# EAGLE schematic ledikuutio (EAGLE 6.1)
Led cube Logic

## Sheet 1 of 3
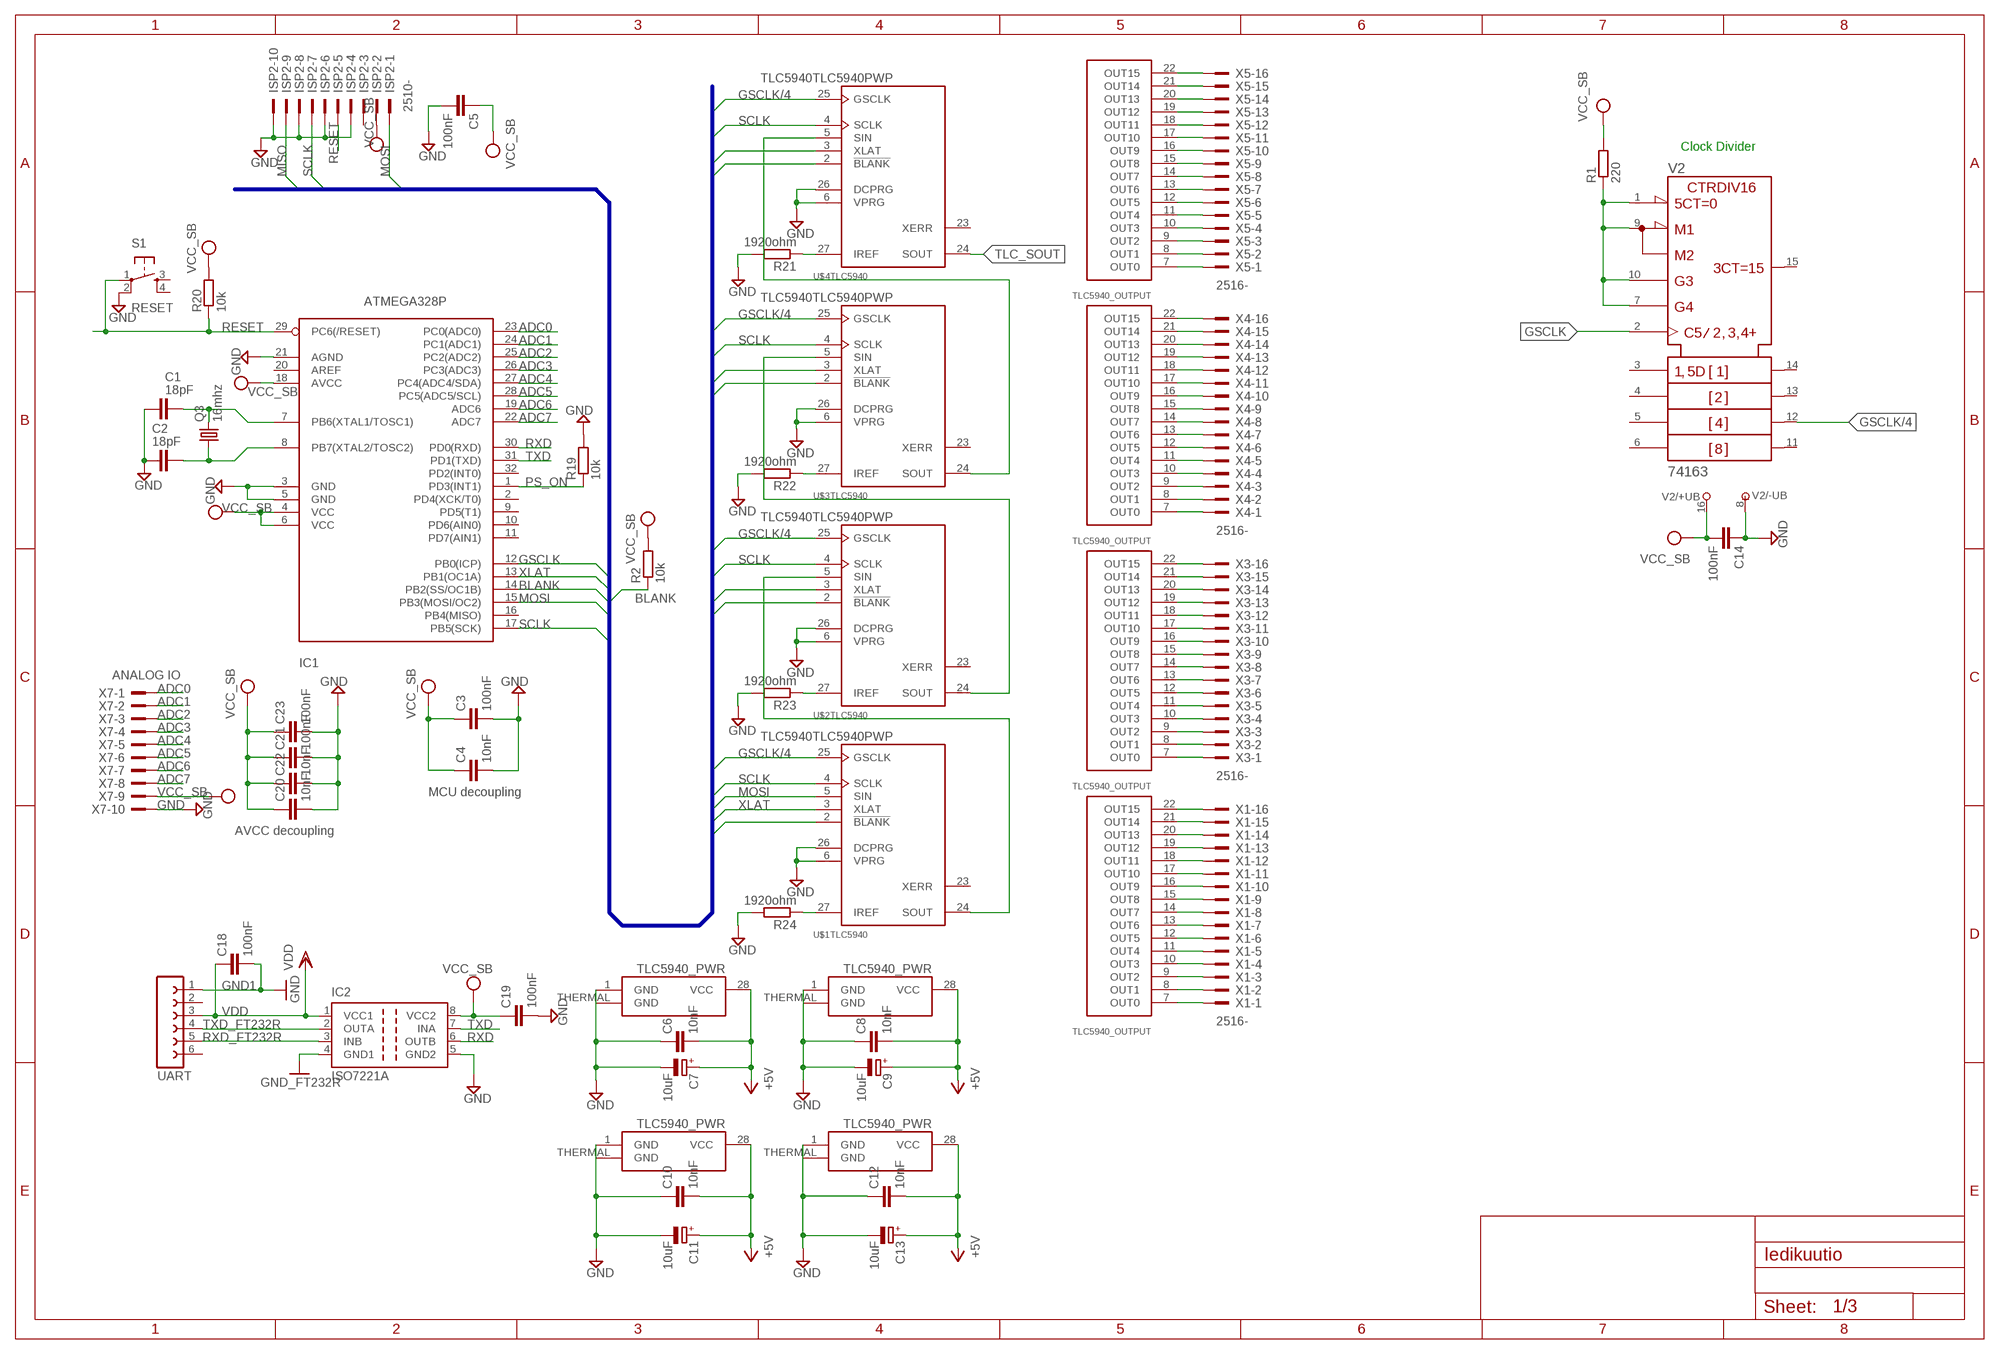
[diagram p0: schematic, sheet 1]

### Parts
C1  18pF  C-EUC0805  [C0805]
C2  18pF  C-EUC0805  [C0805]
C3  100nF  C-EUC0805  [C0805]
C4  10nF  C-EUC0805  [C0805]
C5  100nF  C-EUC0805  [C0805]
C6  10nF  C-EUC0805  [C0805]
C7  10uF  CPOL-EUE2.5-6  [E2,5-6]
C8  10nF  C-EUC0805  [C0805]
C9  10uF  CPOL-EUE2.5-6  [E2,5-6]
C10  10nF  C-EUC0805  [C0805]
C11  10uF  CPOL-EUE2.5-6  [E2,5-6]
C12  10nF  C-EUC0805  [C0805]
C13  10uF  CPOL-EUE2.5-6  [E2,5-6]
C14  100nF  C-EUC0805  [C0805]
C18  100nF  C-EUC0603  [C0603]
C19  100nF  C-EUC0603  [C0603]
C20  10nF  C-EUC0805  [C0805]
C21  100nF  C-EUC0805  [C0805]
C22  10nF  C-EUC0805  [C0805]
C23  100nF  C-EUC0805  [C0805]
IC1  ATMEGA328P  MEGA8-AI  [TQFP32-08]
IC2  ISO7221A  [SO-08]
ISP2  2510-  [PAK100/2500-10]
Q3  16mhz  CRYSTAL5X3  [CRYSTAL-SMD-5X3]
R1  220  R-EU_M0805  [M0805]
R2  10k  R-EU_M0805  [M0805]
R19  10k  R-EU_M0805  [M0805]
R20  10k  R-EU_M0805  [M0805]
R21  1920ohm  R-EU_M0805  [M0805]
R22  1920ohm  R-EU_M0805  [M0805]
R23  1920ohm  R-EU_M0805  [M0805]
R24  1920ohm  R-EU_M0805  [M0805]
S1  RESET  TAC_SWITCHSMD  [TACTILE_SWITCH_SMD]
U$1  TLC5940TLC5940PWP  [PWP28]
U$2  TLC5940TLC5940PWP  [PWP28]
U$3  TLC5940TLC5940PWP  [PWP28]
U$4  TLC5940TLC5940PWP  [PWP28]
UART  FE06-1  [FE06]
V2  74163  [SO16]
X1  2516-  [PAK100/2500-16]
X3  2516-  [PAK100/2500-16]
X4  2516-  [PAK100/2500-16]
X5  2516-  [PAK100/2500-16]
X7  ANALOG IO  2510-  [PAK100/2500-10]

### Nets
+5V [+5V]: C6.2 C7.+ C8.2 C9.+ C10.2 C11.+ C12.2 C13.+ U$1.28(TLC5940_PWR:VCC) U$2.28(TLC5940_PWR:VCC) U$3.28(TLC5940_PWR:VCC) U$4.28(TLC5940_PWR:VCC) ; also sheet 2,3
ADC0: IC1.23(PC0(ADC0)) X7.1
ADC1: IC1.24(PC1(ADC1)) X7.2
ADC2: IC1.25(PC2(ADC2)) X7.3
ADC3: IC1.26(PC3(ADC3)) X7.4
ADC4: IC1.27(PC4(ADC4/SDA)) X7.5
ADC5: IC1.28(PC5(ADC5/SCL)) X7.6
ADC6: IC1.19(ADC6) X7.7
ADC7: IC1.22(ADC7) X7.8
BLANK [digital signal]: IC1.14(PB2(SS/OC1B)) R2.1 U$1.2(TLC5940:!BLANK) U$2.2(TLC5940:!BLANK) U$3.2(TLC5940:!BLANK) U$4.2(TLC5940:!BLANK)
GND: C1.1 C2.2 C3.2 C4.2 C5.2 C6.1 C7.- C8.1 C9.- C10.1 C11.- C12.1 C13.- C14.1 C19.2 C20.2 C21.2 C22.2 C23.2 IC1.3(GND) IC1.5(GND) IC1.21(AGND) IC2.5(GND2) ISP2.4 ISP2.6 ISP2.8 ISP2.10 R19.2 R21.2 R22.2 R23.2 R24.2 S1.2 U$1.1(TLC5940_PWR:GND) U$1.6(TLC5940:VPRG) U$1.26(TLC5940:DCPRG) U$2.1(TLC5940_PWR:GND) U$2.6(TLC5940:VPRG) U$2.26(TLC5940:DCPRG) U$3.1(TLC5940_PWR:GND) U$3.6(TLC5940:VPRG) U$3.26(TLC5940:DCPRG) U$4.1(TLC5940_PWR:GND) U$4.6(TLC5940:VPRG) U$4.26(TLC5940:DCPRG) V2.8(-UB) X7.10 ; also sheet 2,3
GND1: C18.2 IC2.4(GND1) UART.1 ; supply symbol labelled GND, GND_FT232R
GSCLK [digital signal]: IC1.12(PB0(ICP)) V2.2(CLK)
GSCLK/4: U$1.25(TLC5940:GSCLK) U$2.25(TLC5940:GSCLK) U$3.25(TLC5940:GSCLK) U$4.25(TLC5940:GSCLK) V2.12(QC)
MISO: ISP2.9
MOSI [digital signal]: IC1.15(PB3(MOSI/OC2)) ISP2.1 U$1.5(TLC5940:SIN)
N$1: U$1.24(TLC5940:SOUT) U$2.5(TLC5940:SIN)
N$2: C1.2 IC1.7(PB6(XTAL1/TOSC1)) Q3.3
N$3: C2.1 IC1.8(PB7(XTAL2/TOSC2)) Q3.1
N$4: U$2.24(TLC5940:SOUT) U$3.5(TLC5940:SIN)
N$5: R21.1 U$4.27(TLC5940:IREF)
N$6: R23.1 U$2.27(TLC5940:IREF)
N$32: U$1.7(TLC5940_OUTPUT:OUT0) X1.1
N$33: U$1.8(TLC5940_OUTPUT:OUT1) X1.2
N$34: U$1.9(TLC5940_OUTPUT:OUT2) X1.3
N$35: U$1.10(TLC5940_OUTPUT:OUT3) X1.4
N$36: U$1.11(TLC5940_OUTPUT:OUT4) X1.5
N$37: U$1.12(TLC5940_OUTPUT:OUT5) X1.6
N$38: U$1.13(TLC5940_OUTPUT:OUT6) X1.7
N$39: U$1.14(TLC5940_OUTPUT:OUT7) X1.8
N$40: U$1.15(TLC5940_OUTPUT:OUT8) X1.9
N$41: U$1.16(TLC5940_OUTPUT:OUT9) X1.10
N$42: U$1.17(TLC5940_OUTPUT:OUT10) X1.11
N$43: U$1.18(TLC5940_OUTPUT:OUT11) X1.12
N$44: U$1.19(TLC5940_OUTPUT:OUT12) X1.13
N$45: U$1.20(TLC5940_OUTPUT:OUT13) X1.14
N$46: U$1.21(TLC5940_OUTPUT:OUT14) X1.15
N$47: U$1.22(TLC5940_OUTPUT:OUT15) X1.16
N$48: R24.1 U$1.27(TLC5940:IREF)
N$49: U$2.7(TLC5940_OUTPUT:OUT0) X3.1
N$50: U$2.8(TLC5940_OUTPUT:OUT1) X3.2
N$51: U$2.9(TLC5940_OUTPUT:OUT2) X3.3
N$52: U$2.10(TLC5940_OUTPUT:OUT3) X3.4
N$53: U$2.11(TLC5940_OUTPUT:OUT4) X3.5
N$54: U$2.12(TLC5940_OUTPUT:OUT5) X3.6
N$55: U$2.13(TLC5940_OUTPUT:OUT6) X3.7
N$56: U$2.14(TLC5940_OUTPUT:OUT7) X3.8
N$57: U$2.15(TLC5940_OUTPUT:OUT8) X3.9
N$58: U$2.16(TLC5940_OUTPUT:OUT9) X3.10
N$59: U$2.17(TLC5940_OUTPUT:OUT10) X3.11
N$60: U$2.18(TLC5940_OUTPUT:OUT11) X3.12
N$61: U$2.19(TLC5940_OUTPUT:OUT12) X3.13
N$62: U$2.20(TLC5940_OUTPUT:OUT13) X3.14
N$63: U$2.21(TLC5940_OUTPUT:OUT14) X3.15
N$64: U$2.22(TLC5940_OUTPUT:OUT15) X3.16
N$65: U$3.7(TLC5940_OUTPUT:OUT0) X4.1
N$66: U$3.8(TLC5940_OUTPUT:OUT1) X4.2
N$67: U$3.9(TLC5940_OUTPUT:OUT2) X4.3
N$68: U$3.10(TLC5940_OUTPUT:OUT3) X4.4
N$69: U$3.11(TLC5940_OUTPUT:OUT4) X4.5
N$70: U$3.12(TLC5940_OUTPUT:OUT5) X4.6
N$71: U$3.13(TLC5940_OUTPUT:OUT6) X4.7
N$72: U$3.14(TLC5940_OUTPUT:OUT7) X4.8
N$73: U$3.15(TLC5940_OUTPUT:OUT8) X4.9
N$74: U$3.16(TLC5940_OUTPUT:OUT9) X4.10
N$75: U$3.17(TLC5940_OUTPUT:OUT10) X4.11
N$76: U$3.18(TLC5940_OUTPUT:OUT11) X4.12
N$77: U$3.19(TLC5940_OUTPUT:OUT12) X4.13
N$78: U$3.20(TLC5940_OUTPUT:OUT13) X4.14
N$79: U$3.21(TLC5940_OUTPUT:OUT14) X4.15
N$80: U$3.22(TLC5940_OUTPUT:OUT15) X4.16
N$81: U$4.7(TLC5940_OUTPUT:OUT0) X5.1
N$82: U$4.8(TLC5940_OUTPUT:OUT1) X5.2
N$83: U$4.9(TLC5940_OUTPUT:OUT2) X5.3
N$84: U$4.10(TLC5940_OUTPUT:OUT3) X5.4
N$85: U$4.11(TLC5940_OUTPUT:OUT4) X5.5
N$86: U$4.12(TLC5940_OUTPUT:OUT5) X5.6
N$87: U$4.13(TLC5940_OUTPUT:OUT6) X5.7
N$88: U$4.14(TLC5940_OUTPUT:OUT7) X5.8
N$89: U$4.15(TLC5940_OUTPUT:OUT8) X5.9
N$90: U$4.16(TLC5940_OUTPUT:OUT9) X5.10
N$91: U$4.17(TLC5940_OUTPUT:OUT10) X5.11
N$92: U$4.18(TLC5940_OUTPUT:OUT11) X5.12
N$93: U$4.19(TLC5940_OUTPUT:OUT12) X5.13
N$94: U$4.20(TLC5940_OUTPUT:OUT13) X5.14
N$95: U$4.21(TLC5940_OUTPUT:OUT14) X5.15
N$96: U$4.22(TLC5940_OUTPUT:OUT15) X5.16
N$97: U$3.24(TLC5940:SOUT) U$4.5(TLC5940:SIN)
N$98: R1.1 V2.1(!CLR) V2.7(ENP) V2.9(!LOAD) V2.10(ENT)
N$99: R22.1 U$3.27(TLC5940:IREF)
PS_ON [digital signal]: IC1.1(PD3(INT1)) R19.1 ; also sheet 3
RESET: IC1.29(PC6(/RESET)) ISP2.5 R20.1 S1.1
RXD [digital signal]: IC1.30(PD0(RXD)) IC2.6(OUTB)
RXD_FT232R: IC2.3(INB) UART.5
SCLK [digital signal]: IC1.17(PB5(SCK)) ISP2.7 U$1.4(TLC5940:SCLK) U$2.4(TLC5940:SCLK) U$3.4(TLC5940:SCLK) U$4.4(TLC5940:SCLK) ; also sheet 2
TLC_SOUT: U$4.24(TLC5940:SOUT) ; also sheet 2
TXD [digital signal]: IC1.31(PD1(TXD)) IC2.7(INA)
TXD_FT232R: IC2.2(OUTA) UART.4
VCC: C3.1 C4.1 C5.1 C14.2 C19.1 C20.1 C21.1 C22.1 C23.1 IC1.4(VCC) IC1.6(VCC) IC1.18(AVCC) IC2.8(VCC2) ISP2.2 R1.2 R2.2 R20.2 V2.16(+UB) X7.9 ; supply symbol labelled VCC_SB ; also sheet 3
VDD: C18.1 IC2.1(VCC1) UART.3
XLAT [digital signal]: IC1.13(PB1(OC1A)) U$1.3(TLC5940:XLAT) U$2.3(TLC5940:XLAT) U$3.3(TLC5940:XLAT) U$4.3(TLC5940:XLAT) ; also sheet 2
Unconnected: IC1.2(PD4(XCK/T0)) IC1.9(PD5(T1)) IC1.10(PD6(AIN0)) IC1.11(PD7(AIN1)) IC1.16(PB4(MISO)) IC1.20(AREF) IC1.32(PD2(INT0)) ISP2.3 S1.3 S1.4 U$1.23(TLC5940:XERR) U$2.23(TLC5940:XERR) U$3.23(TLC5940:XERR) U$4.23(TLC5940:XERR) UART.2 UART.6 V2.3(A) V2.4(B) V2.5(C) V2.6(D) V2.11(QD) V2.13(QB) V2.14(QA) V2.15(RCO)

### Buses
MOSI,MISO,XLAT,BLANK,DCPRG,VPRG,GSCLK,SCLK,GSCLK/4

### Notes on the sheet
- Clock Divider
- MCU decoupling
- AVCC decoupling

## Sheet 2 of 3
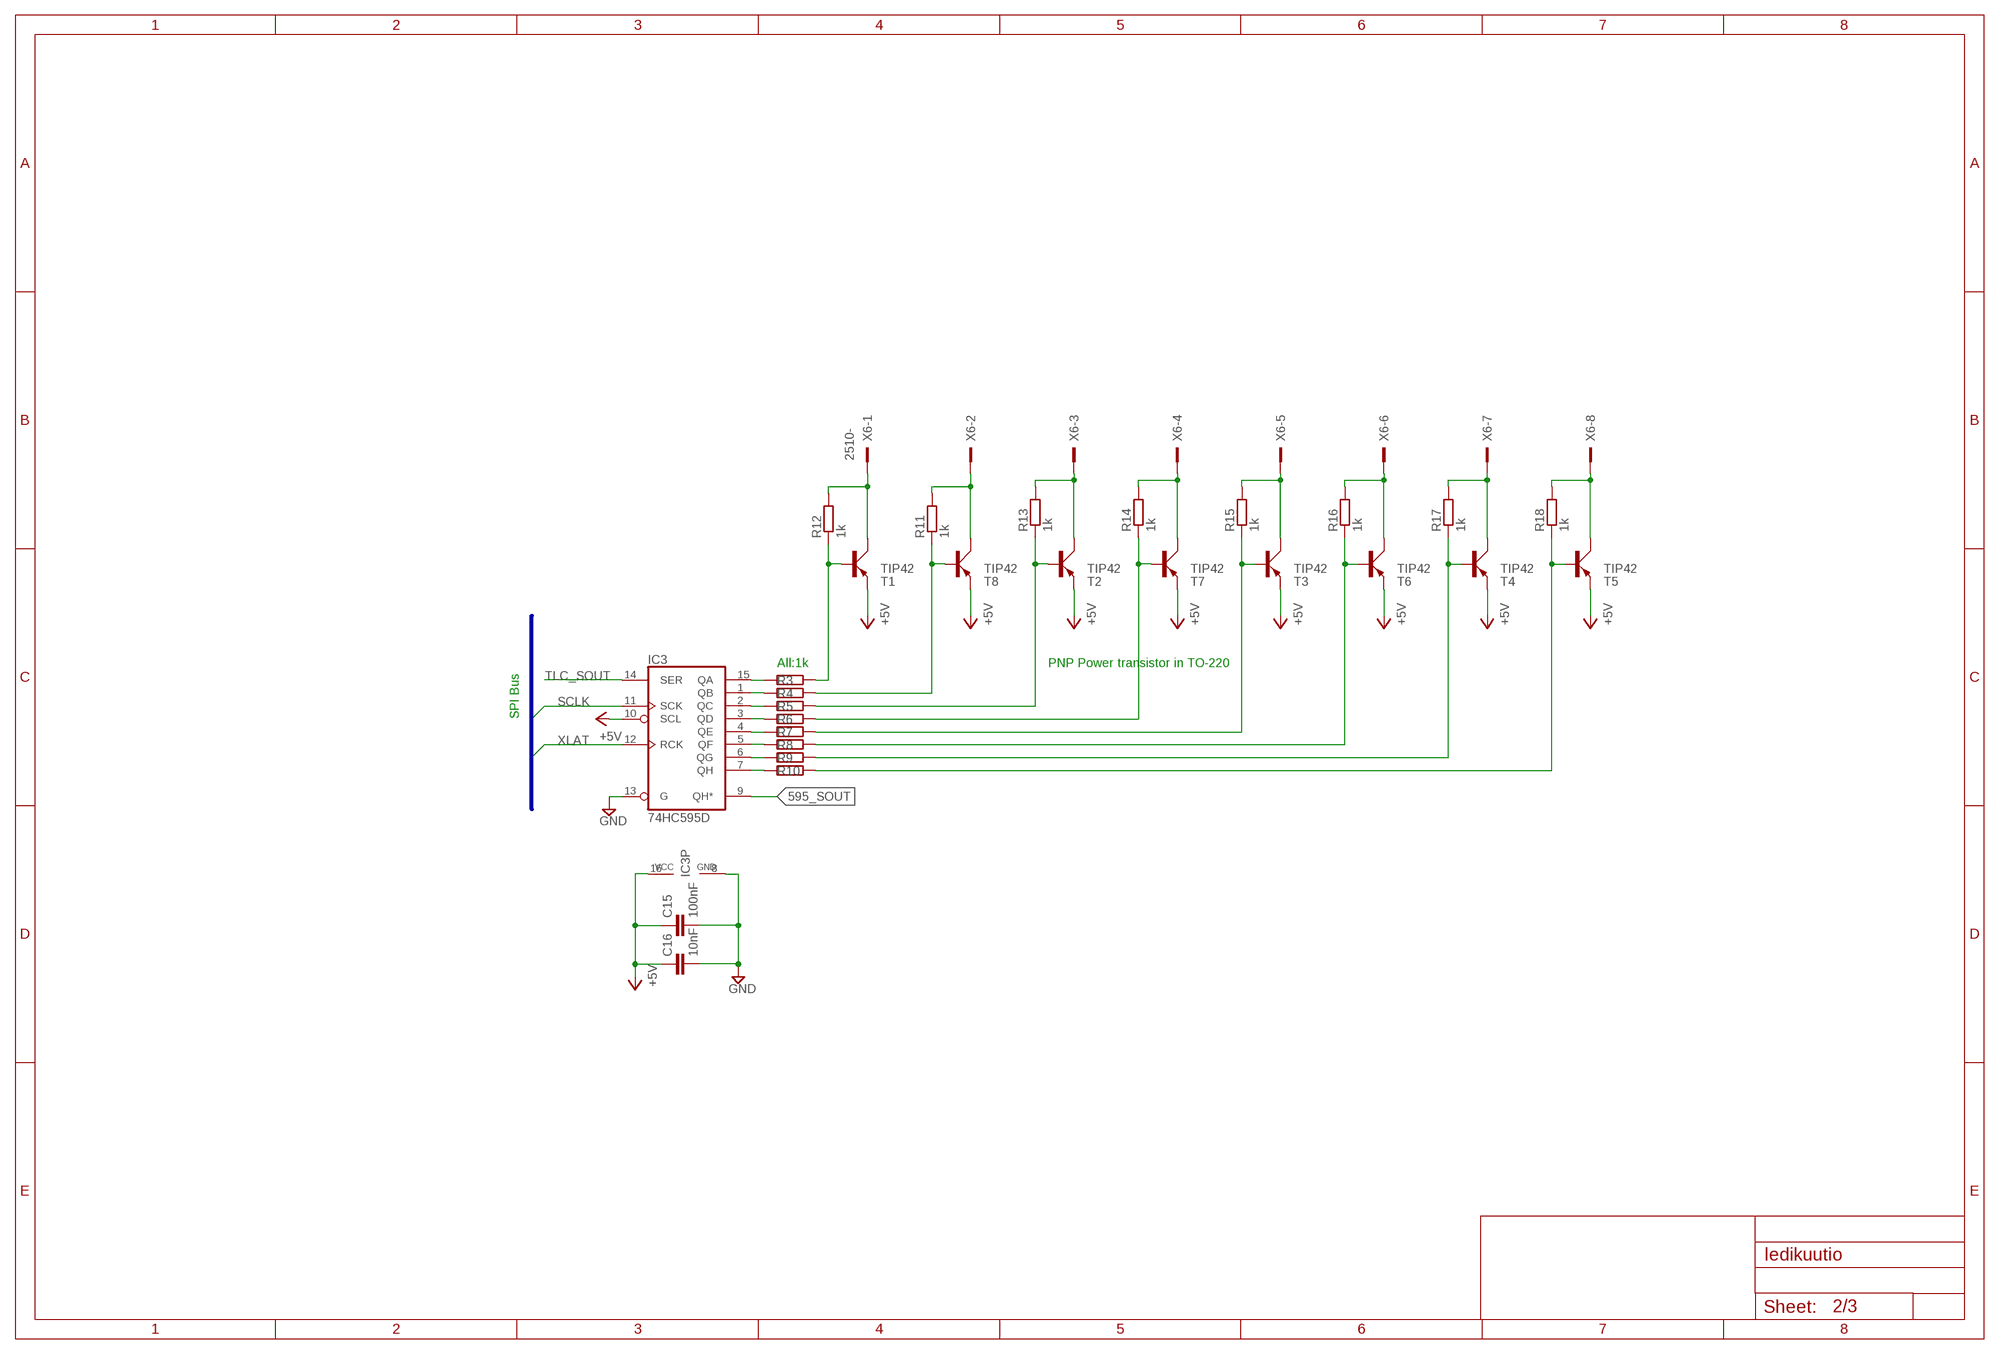
[diagram p1: schematic, sheet 2]

### Parts
C15  100nF  C-EUC0805  [C0805]
C16  10nF  C-EUC0805  [C0805]
IC3  74HC595D  [SO16]
R3  1k  R-EU_M0805  [M0805]
R4  1k  R-EU_M0805  [M0805]
R5  1k  R-EU_M0805  [M0805]
R6  1k  R-EU_M0805  [M0805]
R7  1k  R-EU_M0805  [M0805]
R8  1k  R-EU_M0805  [M0805]
R9  1k  R-EU_M0805  [M0805]
R10  1k  R-EU_M0805  [M0805]
R11  1k  R-EU_M0805  [M0805]
R12  1k  R-EU_M0805  [M0805]
R13  1k  R-EU_M0805  [M0805]
R14  1k  R-EU_M0805  [M0805]
R15  1k  R-EU_M0805  [M0805]
R16  1k  R-EU_M0805  [M0805]
R17  1k  R-EU_M0805  [M0805]
R18  1k  R-EU_M0805  [M0805]
T1  TIP42  TIP42C  [TO220AV]
T2  TIP42  TIP42C  [TO220AV]
T3  TIP42  TIP42C  [TO220AV]
T4  TIP42  TIP42C  [TO220AV]
T5  TIP42  TIP42C  [TO220AV]
T6  TIP42  TIP42C  [TO220AV]
T7  TIP42  TIP42C  [TO220AV]
T8  TIP42  TIP42C  [TO220AV]
X6  2510-  [PAK100/2500-10]

### Nets
595_SOUT: IC3.9(QH*)
+5V [+5V]: C15.1 C16.1 IC3.10(SCL) IC3.16(VCC) T1.E T2.E T3.E T4.E T5.E T6.E T7.E T8.E ; also sheet 1,3
GND: C15.2 C16.2 IC3.8(GND) IC3.13(G) ; also sheet 1,3
N$7: R11.2 T8.C X6.2
N$8: R14.2 T7.C X6.4
N$9: R16.2 T6.C X6.6
N$10: R18.2 T5.C X6.8
N$11: R12.2 T1.C X6.1
N$12: R13.2 T2.C X6.3
N$13: R15.2 T3.C X6.5
N$14: R17.2 T4.C X6.7
N$15: IC3.15(QA) R3.1
N$16: IC3.1(QB) R4.1
N$17: IC3.2(QC) R5.1
N$18: IC3.3(QD) R6.1
N$19: IC3.4(QE) R7.1
N$20: IC3.5(QF) R8.1
N$21: IC3.6(QG) R9.1
N$22: IC3.7(QH) R10.1
N$23: R5.2 R13.1 T2.B
N$24: R3.2 R12.1 T1.B
N$25: R4.2 R11.1 T8.B
N$26: R6.2 R14.1 T7.B
N$27: R7.2 R15.1 T3.B
N$28: R8.2 R16.1 T6.B
N$29: R9.2 R17.1 T4.B
N$30: R10.2 R18.1 T5.B
SCLK [digital signal]: IC3.11(SCK) ; also sheet 1
TLC_SOUT: IC3.14(SER) ; also sheet 1
XLAT [digital signal]: IC3.12(RCK) ; also sheet 1
Unconnected: X6.9 X6.10

### Buses
MOSI,MISO,XLAT,BLANK,DCPRG,VPRG,GSCLK,SCLK

### Notes on the sheet
- All:1k | PNP Power transistor in TO-220
- SPI Bus

## Sheet 3 of 3
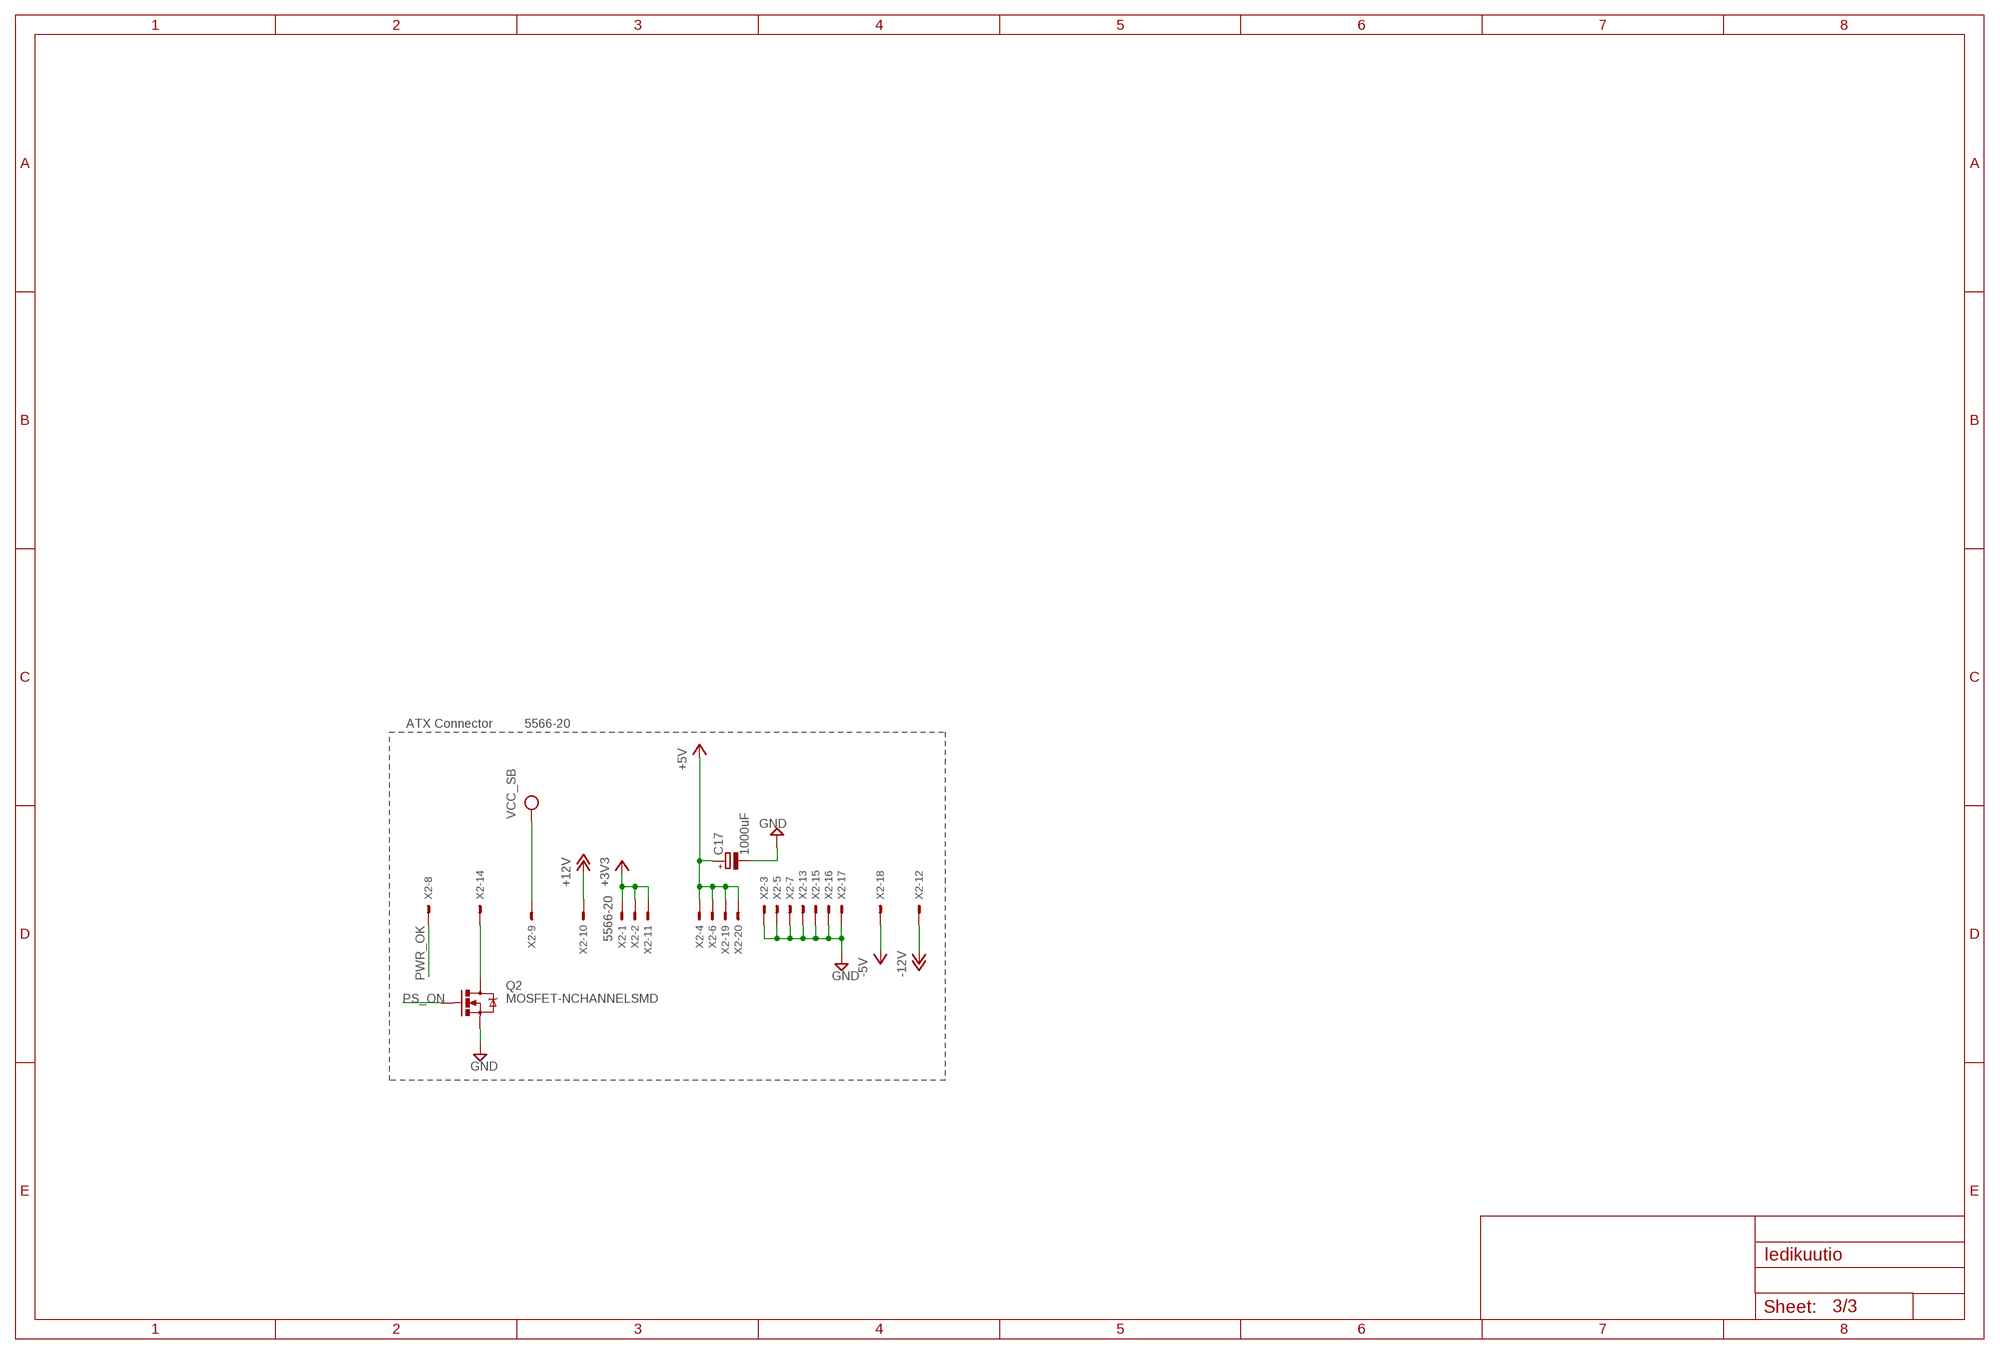
[diagram p2: schematic, sheet 3]

### Parts
C17  1000uF  CPOL-EUE3.5-10  [E3,5-10]
Q2  MOSFET-NCHANNELSMD  [SOT23-3]
X2  5566-20  [5566-20]

### Nets
+3V3: X2.1 X2.2 X2.11
+5V [+5V]: C17.+ X2.4 X2.6 X2.19 X2.20 ; also sheet 1,2
+12V: X2.10
-5V: X2.18
-12V: X2.12
GND: C17.- Q2.2(S) X2.3 X2.5 X2.7 X2.13 X2.15 X2.16 X2.17 ; also sheet 1,2
N$31: Q2.3(D) X2.14
PS_ON [digital signal]: Q2.1(G) ; also sheet 1
PWR_OK: X2.8
VCC: X2.9 ; supply symbol labelled VCC_SB ; also sheet 1

### Notes on the sheet
- ATX Connector

## Power pins joined to a net without a drawn wire
GND: U$1.THERMAL(TLC5940_PWR:GND) U$2.THERMAL(TLC5940_PWR:GND) U$3.THERMAL(TLC5940_PWR:GND) U$4.THERMAL(TLC5940_PWR:GND)

## Library data of the parts
C1-C6 C8 C10 C12 C14-C16 C18-C23 = rcl:C-EU: CAPACITOR, European symbol
C7 C9 C11 C13 C17 = rcl:CPOL-EU: POLARIZED CAPACITOR, European symbol
IC1 = atmel:MEGA8: MICROCONTROLLER 8 Kbytes FLASH, 1 kbytes SRAM, 512 bytes EEPROM, USART, 6-channel 10 bit ADC, 2-channel 8 bit ADC Pin compatible with Atmega48, ATMega88, ATMega168 Source: avr.lbr
IC2 = texas:ISO7221: DUAL DIGITAL ISOLATORS Source: http://focus.ti.com/lit/ds/symlink/iso7221a.pdf
IC3 = 74xx-eu:74*595: 8-bit SHIFT REGISTER, output latch
ISP2 X6 X7 = con-3m:2510-: 3M (TM) Pak 100 4-Wall Header Source: 3M
Q2 = SparkFun:MOSFET-NCHANNEL
Q3 = SparkFun:CRYSTAL: Crystals Various standard crystals. Proven footprints. Spark Fun Electronics SKU : COM-00534
R1-R24 = rcl:R-EU_: RESISTOR, European symbol
S1 = SparkFun:TAC_SWITCH: Momentary Switch Button commonly used for reset or general input. Spark Fun Electronics SKU : COM-00097
T1-T8 = elovalo:TIP42C: PNP TRANSISTOR
U$1-U$4 = elovalo:TLC5940: 16-channel 12bit pwm constant current sink with SPI serial interface.
UART = elovalo:FE06-1: FEMALE HEADER
V2 = 74ttl-din:74*163: Synchrounus 4-bit COUNTER
X1 X3-X5 = con-3m:2516-: 3M (TM) Pak 100 4-Wall Header Source: 3M
X2 = con-molex:5566-20: Mini FIT connector 20 pol ATX PC-Motherboard Power connector Source: http://www.molex.com

## Net classes
1 digital signal: width 0.15 mm, drill 0.6 mm, clearance 0.15 mm